# EAGLE design pCloud_ESP9266 (EAGLE 9.6.2)
COMPANY: Prime Batteries; DRAWN: Dumitrescu Adrian; REV: B

## Sheet 1 of 3: CAN 1
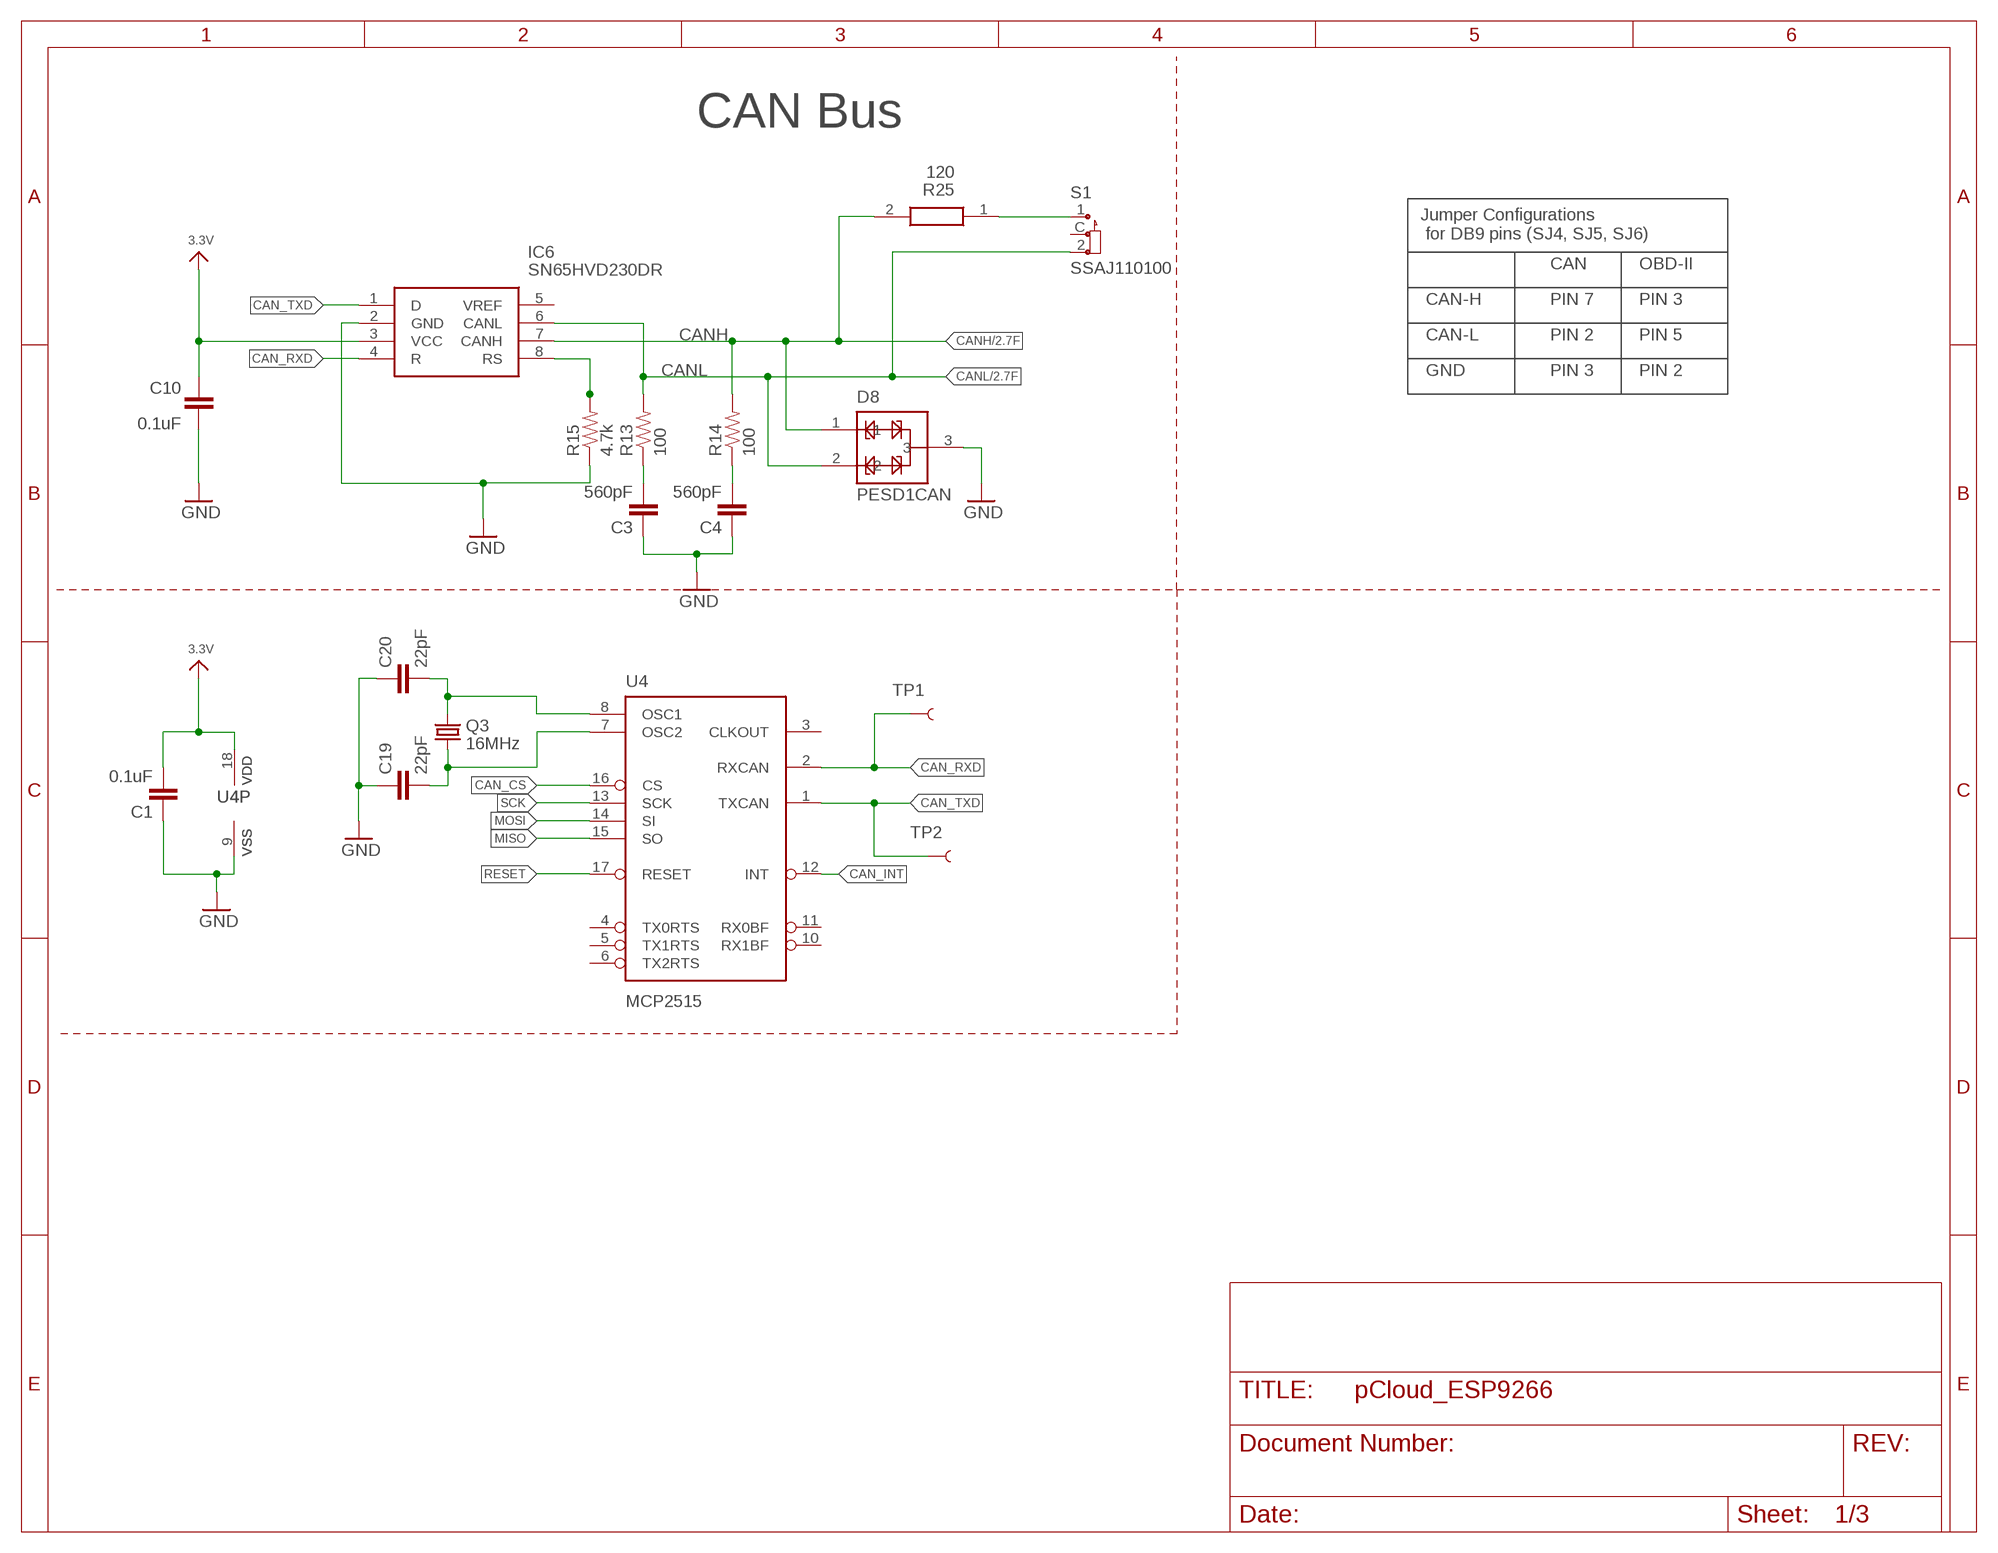
[diagram p0: schematic, sheet 1]

### Parts
C1  0.1uF  0.1UF-0603-25V-(+80/-20%)  [0603]
C3  560pF  560PF-0603-50V-5%  [0603]
C4  560pF  560PF-0603-50V-5%  [0603]
C10  0.1uF  0.1UF-0603-25V-(+80/-20%)  [0603]
C19  22pF  22PF-0603-50V-5%  [0603]
C20  22pF  22PF-0603-50V-5%  [0603]
D8  PESD1CAN  [SOT23-3]
IC6  SN65HVD230DR  [SOT127P600X175-8N]
Q3  16MHz  CRYSTAL5X3  [CRYSTAL-SMD-5X3]
R13  100  100OHM-0603-1/10W-1%  [0603]
R14  100  100OHM-0603-1/10W-1%  [0603]
R15  4.7k  4.7KOHM-0603-1/10W-1%  [0603]
R25  120  RC0603JR-7W120RL  [RESC1608X55N]
S1  SSAJ110100  [SW_SSAJ110100]
TP1  TEST-POINT3X5  [PAD.03X.05]
TP2  TEST-POINT3X5  [PAD.03X.05]
U4  MCP2515  MCP2510SO  [SO-18W]

### Nets
3.3V: C1.2 C10.2 IC6.3(VCC) U4.18(VDD) ; also sheet 2,3
CAN_CS: U4.16(CS) ; also sheet 2
CAN_INT: U4.12(INT) ; also sheet 2
CAN_RXD: IC6.4(R) TP1.P$1 U4.2(RXCAN)
CAN_TXD: IC6.1(D) TP2.P$1 U4.1(TXCAN)
CANH: D8.1 IC6.7(CANH) R14.2 R25.2 ; also sheet 2
CANL: D8.2 IC6.6(CANL) R13.2 S1.2 ; also sheet 2
GND: C1.1 C3.1 C4.1 C10.1 C19.1 C20.1 D8.3 IC6.2(GND) R15.1 U4.9(VSS) ; also sheet 2,3
MISO: U4.15(SO) ; also sheet 2
MOSI: U4.14(SI) ; also sheet 2,3
N$1: C3.2 R13.1
N$3: C4.2 R14.1
N$17: R25.1 S1.1
N$19: IC6.8(RS) R15.2
N$22: C20.2 Q3.3 U4.8(OSC1)
N$23: C19.2 Q3.1 U4.7(OSC2)
RESET: U4.17(RESET) ; also sheet 2,3
SCK: U4.13(SCK) ; also sheet 2,3
Unconnected: IC6.5(VREF) S1.C U4.3(CLKOUT) U4.4(TX0RTS) U4.5(TX1RTS) U4.6(TX2RTS) U4.10(RX1BF) U4.11(RX0BF)

### Notes on the sheet
- CAN Bus
- Jumper Configurations
   for DB9 pins (SJ4, SJ5, SJ6)
- CAN | OBD-II
- CAN-H | PIN 7 | PIN 3
- CAN-L | PIN 2 | PIN 5
- GND | PIN 3 | PIN 2

## Sheet 2 of 3: ESP8266
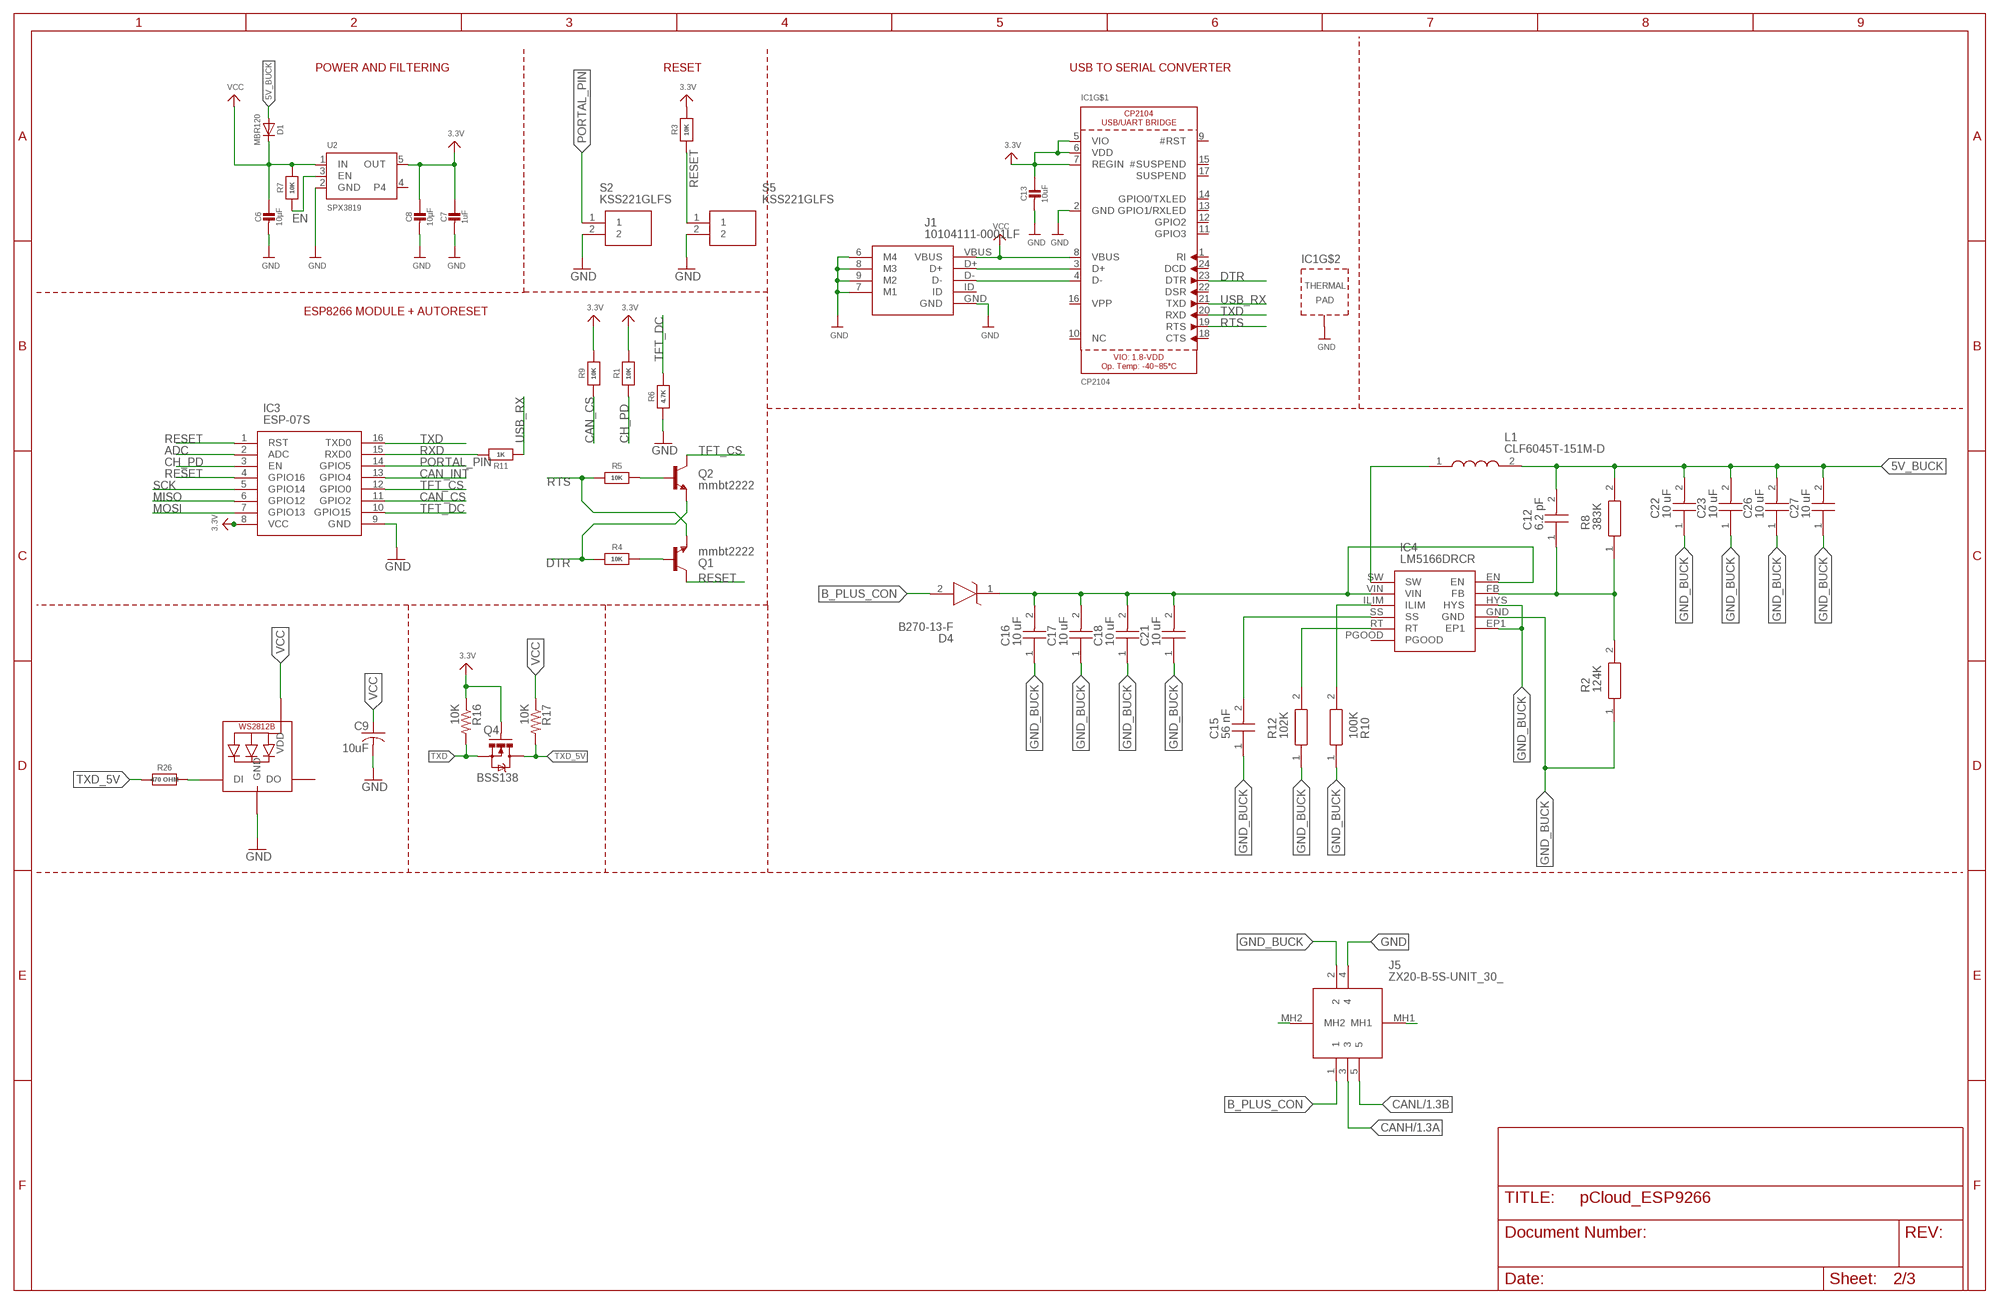
[diagram p1: schematic, sheet 2]

### Parts
C6  10µF  CAP_CERAMIC0805  [0805]
C7  1uF  CAP_CERAMIC0603  [0603]
C8  10µF  CAP_CERAMIC0805  [0805]
C9  10uF  C-USC0805K  [C0805K]
C12  6.2 pF  GCM155R71C473KA37J  [CAPC1005X55N]
C13  10uF  CAP_CERAMIC0805  [0805]
C15  56 nF  GCM155R71C473KA37J  [CAPC1005X55N]
C16  10 uF  GRM32ER72A225KA35L  [CAPC3225X270N]
C17  10 uF  GRM32ER72A225KA35L  [CAPC3225X270N]
C18  10 uF  GRM32ER72A225KA35L  [CAPC3225X270N]
C21  10 uF  GRM32ER72A225KA35L  [CAPC3225X270N]
C22  10 uF  GRM32ER72A225KA35L  [CAPC3225X270N]
C23  10 uF  GRM32ER72A225KA35L  [CAPC3225X270N]
C26  10 uF  GRM32ER72A225KA35L  [CAPC3225X270N]
C27  10 uF  GRM32ER72A225KA35L  [CAPC3225X270N]
D1  MBR120  DIODESOD-123  [SOD-123]
D4  B270-13-F  B270B-13-F  [DIOM5336X250N]
IC1  CP2104  [QFN24_4MM_SMSC]
IC3  ESP-07S  [ESP07S]
IC4  LM5166DRCR  [TPS74901DRCR]
J1  10104111-0001LF  [101041110001LF]
J5  ZX20-B-5S-UNIT_30_  [ZX20B5SUNIT30]
L1  CLF6045T-151M-D  [CLF6045T151MD]
LED4  WS2812B5050  [WS2812B]
Q1  mmbt2222  TRANSISTOR_NPNSOT23-3  [SOT23-3]
Q2  mmbt2222  TRANSISTOR_NPNSOT23-3  [SOT23-3]
Q4  BSS138  MOSFET-NCHANNELSMD  [SOT23-3]
R1  10K  RESISTOR0603  [0603]
R2  124K  RC0402FR-07100KP  [RESC1005X40N]
R3  10K  RESISTOR0603  [0603]
R4  10K  RESISTOR0603  [0603]
R5  10K  RESISTOR_0603MP  [0603]
R6  4.7K  RESISTOR0603  [0603]
R7  10K  RESISTOR0603  [0603]
R8  383K  RC0402FR-07100KP  [RESC1005X40N]
R9  10K  RESISTOR0603  [0603]
R10  100K  RC0402FR-07100KP  [RESC1005X40N]
R11  1K  RESISTOR_0603MP  [0603]
R12  102K  RC0402FR-07100KP  [RESC1005X40N]
R16  10K  RESISTOR0603-RES  [0603]
R17  10K  RESISTOR0603-RES  [0603]
R26  470 OHM  RESISTOR_0805MP  [_0805MP]
S2  KSS221GLFS  [KSS]
S5  KSS221GLFS  [KSS]
U2  SPX3819  VREG_SOT23-5  [SOT23-5]

### Nets
3.3V: C7.1 C8.1 C13.1 IC1.5(VIO) IC1.6(VDD) IC1.7(REGIN) IC3.8(VCC) Q4.1(G) R1.2 R3.2 R9.2 R16.1 U2.5(OUT) ; also sheet 1,3
5V_BUCK: C12.2 C22.2(C2) C23.2(C2) C26.2(C2) C27.2(C2) D1.A L1.2 R8.2
ADC: IC3.2(ADC)
B_PLUS: C16.2(C2) C17.2(C2) C18.2(C2) C21.2(C2) D4.1(K) IC4.EN IC4.VIN
B_PLUS_CON: D4.2(A) J5.1
CAN_CS: IC3.11(GPIO2) R9.1 ; also sheet 1
CAN_INT: IC3.13(GPIO4) ; also sheet 1
CANH: J5.3 ; also sheet 1
CANL: J5.5 ; also sheet 1
CH_PD: IC3.3(EN) R1.1
DTR: IC1.23(DTR) Q2.2(E) R4.1
EN: R7.1 U2.3(EN)
GND: C6.2 C7.2 C8.2 C9.2 C13.2 IC1.2(GND) IC1.THERM(TP) IC3.9(GND) J1.6(M4) J1.7(M1) J1.8(M3) J1.9(M2) J1.GND J5.4 LED4.3-GND(GND) R6.1 S2.2 S5.2 U2.2(GND) ; also sheet 1,3
GND_BUCK: C15.1 C16.1(C1) C17.1(C1) C18.1(C1) C21.1(C1) C22.1(C1) C23.1(C1) C26.1(C1) C27.1(C1) IC4.EP1 IC4.GND IC4.HYS J5.2 R2.1 R10.1 R12.1
MISO: IC3.6(GPIO12) ; also sheet 1
MOSI: IC3.7(GPIO13) ; also sheet 1,3
N$2: IC4.SW L1.1
N$4: IC4.ILIM R10.2
N$6: C12.1 IC4.FB R2.2 R8.1
N$9: IC1.3(D+) J1.D+
N$10: IC1.4(D-) J1.D-
N$12: Q1.1(B) R4.2
N$13: Q2.1(B) R5.2
N$14: C15.2 IC4.SS
N$15: IC4.RT R12.2
N$16: J5.MH2
N$18: J5.MH1
N$26: LED4.4-DIN(DI) R26.2
PORTAL_PIN: IC3.14(GPIO5) S2.1
RESET: IC3.1(RST) IC3.4(GPIO16) Q1.3(C) R3.1 S5.1 ; also sheet 1,3
RTS: IC1.19(RTS) Q1.2(E) R5.1
RXD: IC3.15(RXD0) R11.2
SCK: IC3.5(GPIO14) ; also sheet 1,3
TFT_CS: IC3.12(GPIO0) Q2.3(C) ; also sheet 3
TFT_DC: IC3.10(GPIO15) R6.2 ; also sheet 3
TXD: IC1.20(RXD) IC3.16(TXD0) Q4.2(S) R16.2
TXD_5V: Q4.3(D) R17.2 R26.1
USB_RX: IC1.21(TXD) R11.1
VCC: C6.1 C9.1 D1.C IC1.8(VBUS) J1.VBUS LED4.1-VDD(VDD) R7.2 R17.1 U2.1(IN)
Unconnected: IC1.1(RI) IC1.9(#RST) IC1.10(NC) IC1.11(GPIO3) IC1.12(GPIO2) IC1.13(GPIO1/RXLED) IC1.14(GPIO0/TXLED) IC1.15(#SUSPEND) IC1.16(VPP) IC1.17(SUSPEND) IC1.18(CTS) IC1.22(DSR) IC1.24(DCD) IC4.PGOOD J1.ID LED4.2-DOUT(DO) U2.4

### Notes on the sheet
- POWER AND FILTERING | RESET | USB TO SERIAL CONVERTER
- ESP8266 MODULE + AUTORESET

## Sheet 3 of 3: TFT Display 240x135 ST7789
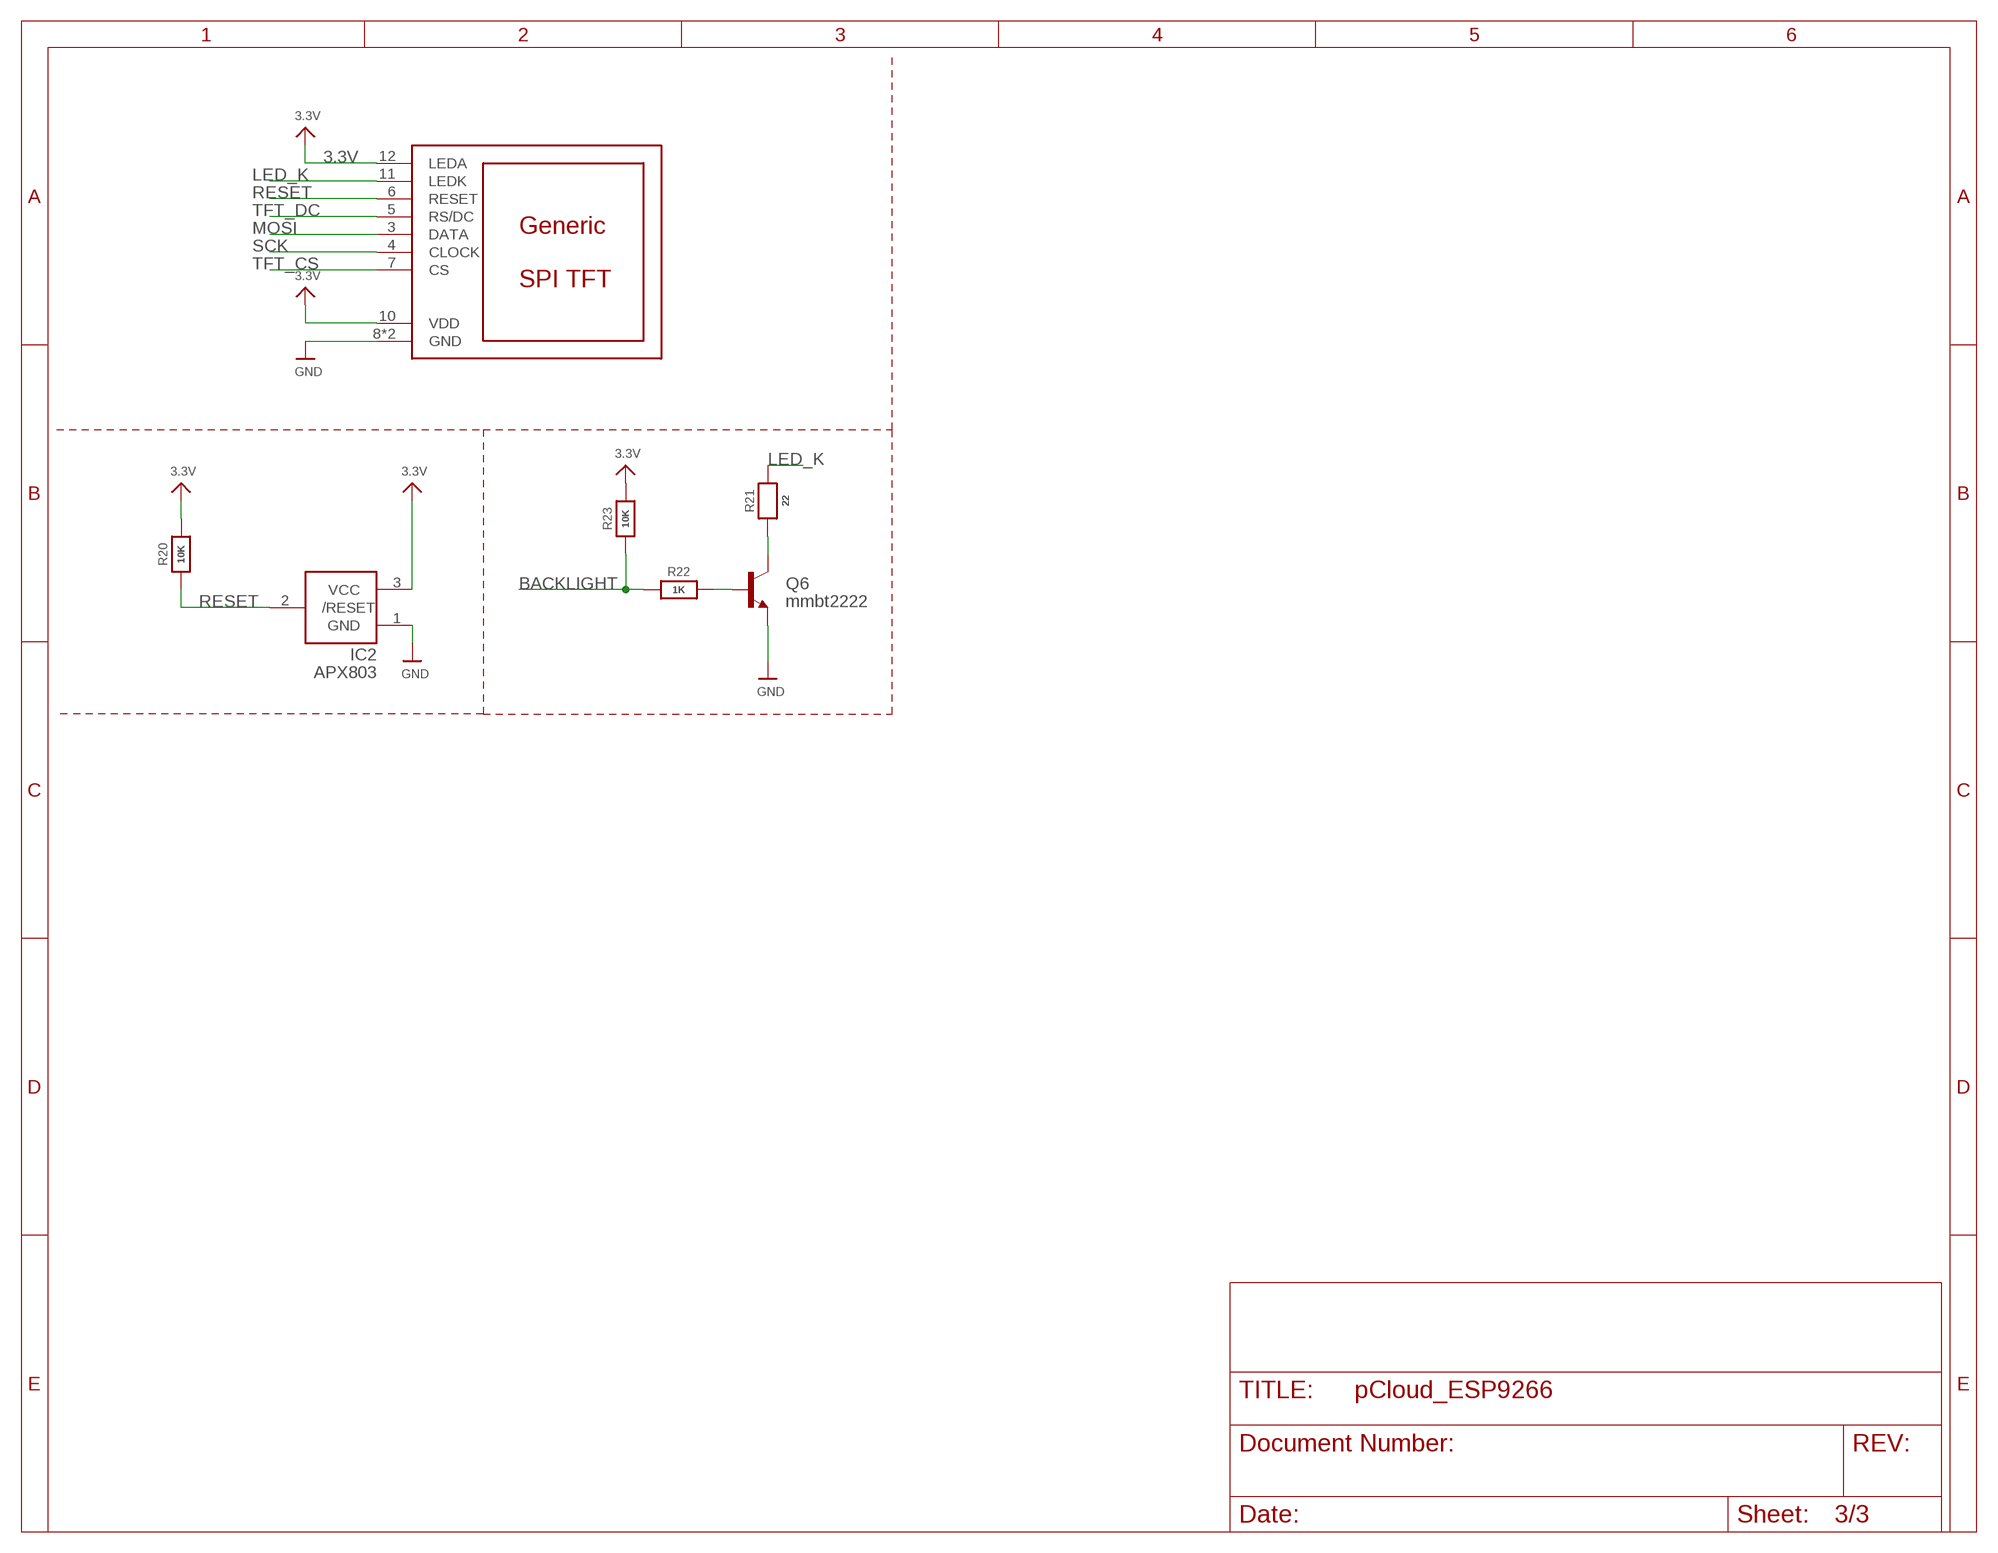
[diagram p2: schematic, sheet 3]

### Parts
DISP1  DISP_LCD_GENERIC_SPI_1.14IN_240X135_WRAPUNDER  [TFT_1.14IN_240X135_WRAPUNDER]
IC2  APX803  AXP083-SAG  [SOT23]
Q6  mmbt2222  TRANSISTOR_NPNSOT23-3  [SOT23-3]
R20  10K  RESISTOR0603  [0603]
R21  22  RESISTOR0603  [0603]
R22  1K  RESISTOR0603  [0603]
R23  10K  RESISTOR0603  [0603]

### Nets
3.3V: DISP1.10(VDD) DISP1.12(LEDA) IC2.3(VCC) R20.2 R23.2 ; also sheet 1,2
BACKLIGHT: R22.1 R23.1
GND: DISP1.8(GND) DISP1.13(GND) IC2.1(GND) Q6.2(E) ; also sheet 1,2
LED_K: DISP1.11(LEDK) R21.2
MOSI: DISP1.3(DATA) ; also sheet 1,2
N$7: Q6.1(B) R22.2
N$11: Q6.3(C) R21.1
RESET: DISP1.6(RESET) IC2.2(/RESET) R20.1 ; also sheet 1,2
SCK: DISP1.4(CLOCK) ; also sheet 1,2
TFT_CS: DISP1.7(CS) ; also sheet 2
TFT_DC: DISP1.5(RS/DC) ; also sheet 2

## Library data of the parts
C1 C10 = SparkFun-Capacitors:0.1UF: 0.1µF ceramic capacitors A capacitor is a passive two-terminal electrical component used to store electrical energy temporarily in an electric field.; PROD_ID: CAP-00810
C3 C4 = SparkFun-Capacitors:560PF: 0.56nF/560pF ceramic capacitors A capacitor is a passive two-terminal electrical component used to store electrical energy temporarily in an electric field.; PROD_ID: CAP-08749
C6-C8 C13 = microbuilder:CAP_CERAMIC: Ceramic Capacitors 0402 - 0402 Surface Mount Capacitors 16pF 50V 5% [Digikey: 445-4899-2-ND] 18pF 50V 5% [Digikey: 490-1281-2-ND] 22pF 50V 5% [Digikey: 490-1283-2-ND] 68pF 50V 5% [Digikey: 490-1289-2-ND] 0.1uF 10V 10% [Digikey: 490-1318-2-ND] 1.0uF 6.3V 10% [Digikey: 490-1320-2-ND] 0603 - 0603 Surface Mount Capacitors 16 pF 50V 5% [Digikey: 445-5051-2-ND] 22 pF 50V [Digikey: PCC220ACVTR-ND] 33 pF 50V 5% [Digikey: 490-1415-1-ND] 56pF 50V 5% [Digikey: 490-1421-1-ND] 220pF 50V 5% [Digikey: 445-1285-1-ND] 680 pF 50V 2200 pF 50V 5% C0G [Digikey: 445-1297-1-ND] 5600 pF 100V 5% X7R [Digikey: 478-3711-1-ND] 0.1 µF 25V 10% [Digikey: PCC2277TR-ND] 0.22 µF 16V 10% X7R [Digikey: 445-1318-1-ND] 1.0 µF 25V 10% [Digikey: 445-5146-2-ND] 0603 - RF Specific 3pF 250V +/-0.1pF RF [Digikey: 712-1347-1-ND] 18 pF 250V 5% [Digikey: 478-3505-1-ND or 712-1322-1-ND] 56 pF 250V 5% C0G RF [Digikey: 490-4867-1-ND] 68 pF 250V RF [Digikey: 490-4868-1-ND] 0805 - 0805 Surface Mount Capacitors 220 pF 250V 2% RF Ceramic Capacitor [Digikey: 712-1398-1-ND] 1000 pF 50V 2% NP0 Ceramic Capacitor [Digikey: 478-3760-1-ND] 0.1 µF 25V 10% Ceramic Capacitor [Digikey: PCC1828TR-ND] 1.0 µF 16V 10% Ceramic Capacitor[Digikey: 490-1691-2-ND] 10.0 µF 10V 10% Ceramic Capacitor[Digikey: 709-1228-1-ND] 10.0 uF 16V 10% Ceramic Capacitor [Digikey: 478-5165-2-ND] 47 uF 6.3V 20% Ceramic Capacitor [Digikey: 587-1779-1-ND or 399-5506-1-ND] 1206 - 1206 Surface Mount Capacitors 47uF 10V 20% Ceramic Capacitor [Digikey: 490-5528-1-ND or 399-5508-1-ND or 445-6010-1-ND] 100uF 6.3V -20%, +80% Y5V Ceramic Capacitor (Digikey: 490-4512-1-ND, Mouser: 81-GRM31CF50J107ZE1L)
C9 = rcl:C-US: CAPACITOR, American symbol; SPICEPREFIX: C
C12 C15 = GCM155R71C473KA37J:GCM155R71C473KA37J: Capacitor GCM15 L=1.0mm W=0.5mm T=0.5mm Source: Datasheet <https://psearch.en.murata.com/capacitor/product/GCM155R71C473KA37#.html>; ARROW_PART_NUMBER: GCM155R71C473KA37J; DESCRIPTION: Capacitor GCM15 L=1.0mm W=0.5mm T=0.5mm; HEIGHT: 0.55mm; MANUFACTURER_NAME: Murata Electronics; MANUFACTURER_PART_NUMBER: GCM155R71C473KA37J; MOUSER_PART_NUMBER: 81-GCM155R71C473KA7J; MOUSER_PRICE-STOCK: https://www.mouser.co.uk/ProductDetail/Murata-Electronics/GCM155R71C473KA37J?qs=N3Kl9KD794QyuG7xlAebbw%3D%3D
C16-C18 C21-C23 C26 C27 = GRM32ER72A225KA35L:GRM32ER72A225KA35L: CAPACITOR, 1210 2.2uF +/-10% 100V Source: Datasheet; ARROW_PART_NUMBER: GRM32ER72A225KA35L; ARROW_PRICE-STOCK: https://www.arrow.com/en/products/grm32er72a225ka35l/murata-manufacturing; DESCRIPTION: CAPACITOR, 1210 2.2uF +/-10% 100V; HEIGHT: mm; MANUFACTURER_NAME: Murata Electronics; MANUFACTURER_PART_NUMBER: GRM32ER72A225KA35L; MOUSER_PART_NUMBER: 81-GRM32ER72A225KA35; MOUSER_PRICE-STOCK: https://www.mouser.co.uk/ProductDetail/Murata-Electronics/GRM32ER72A225KA35L?qs=CHiu0TXTCq%252BaecLZfNuvaA%3D%3D
C19 C20 = SparkFun-Capacitors:22PF: 22pF ceramic capacitors A capacitor is a passive two-terminal electrical component used to store electrical energy temporarily in an electric field.; PROD_ID: CAP-07876
D1 = microbuilder:DIODE: Diode SMA Model Volts Amps Type Vf Vr Digikey # Notes SSA34-E3 40V 3A Schottky 480mV @ 3A 200uA @ 40V SSA34-E3/61TGITR-ND CDBA120-G 20V 1A Schottky 500mV @ 1A 500uA @ 20V 641-1014-6-ND REEL MBRA210 10V 2A Schottky 350mV @ 2A 700uA @ 10V MBRA210LT3 SOD-123 Model Volts Amps Type Vf Vr Order # Notes BAT54T1G 30V 200mA Schottky 800mV @ 200mA 2uA @ 25V BAT54T1GOSTR-ND B0530W 30V 500mA Schottky 430mV @ 500mA 130uA @ 30V B0530W-FDICT-ND REEL MBR120 1A 20V Schottky 340mV @ 1A MBR120VLSFT1GOSCT-ND SOD-323 Model Volts Amps Type Vf Vr Order # Notes PMEG2005EJ 20V 500mA Schottky 355mV @ 500mA 568-4110-1-ND ZLLS410 10V 570mA Schottky 380mV @ 570mA ZLLS410CT-ND 1N4148WS 75V 150mA Silicon/Simple 1V 1N4148WSFSCT-ND REEL SOD-523 Model Volts Amps Type Vf Vr Order # Notes BAT54XV2 30V 200mA Schottky 0.8V @ 100mA BAT54XV2CT-ND TB751S 30V 30mA Schottky RB751S-40TE61CT-ND SOT23-R/W (R = Solder Paste/Reflow Ovens, W = Hand-Soldering) Model Volts Amps Type Vf Vr Order # Notes BAT54FILM 40V 300mA Schottky 497-7162-1-ND
D4 = B270B-13-F:B270B-13-F: Diodes Inc B170B-13-F, SMT Schottky Diode, 70V 1A, 2-Pin DO-214AA Source: Datasheet <http://uk.rs-online.com/web/p/products/7513219>; ARROW_PART_NUMBER: B170B-13-F; ARROW_PRICE-STOCK: https://www.arrow.com/en/products/b170b-13-f/diodes-incorporated; DESCRIPTION: Diodes Inc B170B-13-F, SMT Schottky Diode, 70V 1A, 2-Pin DO-214AA; HEIGHT: 2.5mm; MANUFACTURER_NAME: Diodes Inc.; MANUFACTURER_PART_NUMBER: B170B-13-F
D8 = SparkFun-DiscreteSemi:PESD1CAN: PESD1CAN is used to protect two automotive CAN bus lines from ESD.; PROD_ID: DIO-12501
DISP1 = microbuilder:DISP_LCD_GENERIC_SPI
IC1 = microbuilder:CP2104: CP2104 - USB to UART Bridge VDD Output: 3.45V
IC2 = adafruit:AXP083
IC3 = ESP-07S:ESP-07S: RF Solutions ESP-07S 3 3.6V WiFi Module, FTP, HTTP, IPv4, TCP/IP GPIO, HSPI, I2C, I2S, IR, PWM, UART Source: Datasheet <https://www.rfsolutions.co.uk/downloads/1494602250ESP-07S_Datasheet.pdf>; DESCRIPTION: RF Solutions ESP-07S 3 3.6V WiFi Module, FTP, HTTP, IPv4, TCP/IP GPIO, HSPI, I2C, I2S, IR, PWM, UART; HEIGHT: 3mm; MANUFACTURER_NAME: RF SOLUTIONS; MANUFACTURER_PART_NUMBER: ESP-07S; MOUSER_PART_NUMBER: 223-ESP-07S; MOUSER_PRICE-STOCK: https://www.mouser.com/Search/Refine.aspx?Keyword=223-ESP-07S; RS_PART_NUMBER: 1372785; RS_PRICE-STOCK: http://uk.rs-online.com/web/p/products/1372785
IC4 = LM5166DRCR:LM5166DRCR: 3V-65V Input, 500mA Synchronous Buck Converter With Ultra-Low Iq Source: Datasheet <http://www.ti.com/lit/gpn/LM5166>; ARROW_PART_NUMBER: LM5166DRCR; ARROW_PRICE-STOCK: https://www.arrow.com/en/products/lm5166drcr/texas-instruments; DESCRIPTION: 3V-65V Input, 500mA Synchronous Buck Converter With Ultra-Low Iq; HEIGHT: mm; MANUFACTURER_NAME: Texas Instruments; MANUFACTURER_PART_NUMBER: LM5166DRCR; MOUSER_PART_NUMBER: 595-LM5166DRCR; MOUSER_PRICE-STOCK: https://www.mouser.co.uk/ProductDetail/Texas-Instruments/LM5166DRCR?qs=34RfhUjJmKfBnYp2E2XqEQ%3D%3D
IC6 = SN65HVD230DR:SN65HVD230DR: 3.3 V CAN Transceiver with Standby Mode Source: Datasheet <http://www.ti.com/lit/gpn/sn65hvd230>; ARROW_PART_NUMBER: SN65HVD230DR; ARROW_PRICE-STOCK: https://www.arrow.com/en/products/sn65hvd230dr/texas-instruments; DESCRIPTION: 3.3 V CAN Transceiver with Standby Mode; HEIGHT: 1.75mm; MANUFACTURER_NAME: Texas Instruments; MANUFACTURER_PART_NUMBER: SN65HVD230DR; MOUSER_PART_NUMBER: 595-SN65HVD230DR; MOUSER_PRICE-STOCK: https://www.mouser.co.uk/ProductDetail/Texas-Instruments/SN65HVD230DR?qs=QViXGNcIEAtifeQR3pYVUQ%3D%3D
J1 = 10104111-0001LF:10104111-0001LF: USB Connectors 5P Quick Connect MicroUSB TypeAB Rcpt Source: Datasheet <https://cdn.amphenol-icc.com/media/wysiwyg/files/drawing/10104111.pdf>; ARROW_PART_NUMBER: 10104111-0001LF; ARROW_PRICE-STOCK: https://www.arrow.com/en/products/10104111-0001lf/amphenol-fci; DESCRIPTION: USB Connectors 5P Quick Connect MicroUSB TypeAB Rcpt; HEIGHT: 3.07mm; MANUFACTURER_NAME: Amphenol; MANUFACTURER_PART_NUMBER: 10104111-0001LF; MOUSER_PART_NUMBER: 649-10104111-0001LF; MOUSER_PRICE-STOCK: https://www.mouser.co.uk/ProductDetail/Amphenol-FCI/10104111-0001LF?qs=3wMSRtz0%252BRo6OB1MLyfdZQ%3D%3D
J5 = ZX20-B-5S-UNIT_30_:ZX20-B-5S-UNIT_30_: ZX series micro B USB PCB plug, 5P Source: Datasheet <https://www.hirose.com/product/en/download_file/key_name/ZX20-B-5S-UNIT(30)/category/Drawing (2D)/doc_file_id/55228/?file_category_id=6&item_id=02420012830&is_series=>; ARROW_PART_NUMBER: ZX20-B-5S-UNIT(30); ARROW_PRICE-STOCK: https://www.arrow.com/en/products/zx20-b-5s-unit-30/hirose-electric; DESCRIPTION: ZX series micro B USB PCB plug, 5P; HEIGHT: 12mm; MANUFACTURER_NAME: Hirose; MANUFACTURER_PART_NUMBER: ZX20-B-5S-UNIT(30); MOUSER_PART_NUMBER: 798-ZX20-B-5S-UNIT30; MOUSER_PRICE-STOCK: https://www.mouser.co.uk/ProductDetail/Hirose-Connector/ZX20-B-5S-UNIT30?qs=4J5DPWWS9EDebfocK0CE4A%3D%3D
L1 = CLF6045T-151M-D:CLF6045T-151M-D: TDK CLF6045-D Series Shielded Wire-wound SMD Inductor with a Ferrite Core, 150 uH +/-20% 0.6A Idc Source: Datasheet <https://product.tdk.com/en/search/inductor/inductor/smd/info?part_no=CLF6045T-151M-D>; ARROW_PART_NUMBER: CLF6045T-151M-D; ARROW_PRICE-STOCK: https://www.arrow.com/en/products/clf6045t-151m-d/tdk; DESCRIPTION: TDK CLF6045-D Series Shielded Wire-wound SMD Inductor with a Ferrite Core, 150 uH +/-20% 0.6A Idc; HEIGHT: 4.8mm; MANUFACTURER_NAME: TDK; MANUFACTURER_PART_NUMBER: CLF6045T-151M-D; MOUSER_PART_NUMBER: 810-CLF6045T-151M-D; MOUSER_PRICE-STOCK: https://www.mouser.co.uk/ProductDetail/TDK/CLF6045T-151M-D?qs=ilIqL0%2F%2FoDUAXj%252B6amo8qA%3D%3D
LED4 = adafruit:WS2812B
Q1 Q2 Q6 = SparkFun:TRANSISTOR_NPN: Transistor NPN BJT configuration in SOT23 package. MMBT2222 is the common NPN we use. Double check BCE configuration again layout.
Q3 = SparkFun-FreqCtrl:CRYSTAL: Various standard crystals. Proven footprints.; PROD_ID: XTAL-08218
Q4 = SparkFun:MOSFET-NCHANNEL
R1 R3-R7 R9 R11 R20-R23 R26 = microbuilder:RESISTOR: Resistors 0402 - 0402 Surface Mount Package 22 Ohm 1% 1/16W [Digikey: 311-22.0LRTR-ND] 33 Ohm 5% 1/16W 1.0K 5% 1/16W 1.5K 5% 1/16W 2.0K 1% 1/16W 10.0K 1% 1/16W [Digikey: 311-10.0KLRTR-ND] 10.0K 5% 1/16W [Digikey: RMCF0402JT10K0TR-ND] 12.1K 1% 1/16W [Digikey: 311-22.0LRTR-ND] 100.0K 5% 1/16W 0603 - 0603 Surface Mount Package 0 Ohm 1/10 Watt 1% Resistor 15 Ohm 1/10 Watt 1% Resistor 33 Ohm 1/10 Watt 1% Resistor 49.9 Ohm 1/10 Watt 1% Resistor 100 Ohm 1/10 Watt 1% Resistor 150 Ohm 1/10 Watt 1% Resistor 240 Ohm 1/10 Watt 1% Resistor 390 Ohm 1/10 Watt 1% Resistor 560 Ohm 1/10 Watt 1% Resistor 680 Ohm 1/10 Watt 1% Resistor 750 Ohm 1/10 Watt 1% Resistor 1.0K Ohm 1/10 Watt 1% Resistor 1.5K Ohm 1/10 Watt 1% Resistor 2.0K Ohm 1/10 Watt 1% Resistor 2.2K Ohm 1/10 Watt 1% Resistor 3.3K Ohm 1/10 Watt 1% Resistor 4.7K Ohm 1/10 Watt 1% Resistor 10.0K Ohm 1/10 Watt 1% Resistor 12.0K Ohm 1/10 Watt 1% Resistor 12.1K Ohm 1/10 Watt 1% Resistor 20.0K Ohm 1/10 Watt 1% Resistor 33.0K Ohm 1/10 Watt 1% Resistor 100.0K Ohm 1/10 Watt 1% Resistor 0805 - 0805 Surface Mount Package 0 Ohm 1/8 Watt 1% Resistor 33 Ohm 1/8 Watt 1% Resistor 100 Ohm 1/8 Watt 1% Resistor 150 Ohm 1/8 Watt 1% Resistor 200 Ohm 1/8 Watt 1% Resistor 240 Ohm 1/8 Watt 1% Resistor 330 Ohm 1/8 Watt 1% Resistor 390 Ohm 1/8 Watt 1% Resistor 470 Ohm 1/8 Watt 1% Resistor 1.0K Ohm 1/8 Watt 1% Resistor 1.5K Ohm 1/8 Watt 1% Resistor 2.0K Ohm 1/8 Watt 1% Resistor 4.7K Ohm 1/8 Watt 1% Resistor 5.1K Ohm 1/8 Watt 1% Resistor 5.6K Ohm 1/8 Watt 1% Resistor 10.0K Ohm 1/8 Watt 1% Resistor 22.0K Ohm 1/8 Watt 1% Resistor 33.0K Ohm 1/8 Watt 1% Resistor 100K Ohm 1/8 Watt 1% Resistor 1206 - 1206 Surface Mount Package 2012 - 2010 Surface Mount Package 0.11 Ohm 1/2 Watt 1% Resistor - Digikey: RHM.11UCT-ND
R2 R8 R10 R12 = RC0402FR-07100KP:RC0402FR-07100KP: Res Thick Film 0402 100K Ohm 1% 0.063W(1/16W) +/-150ppm/C Epoxy Pad SMD T/R Source: Datasheet <https://www.arrow.com/en/products/rc0402fr-07100kp/yageo>; ARROW_PART_NUMBER: RC0402FR-07100KP; ARROW_PRICE-STOCK: https://www.arrow.com/en/products/rc0402fr-07100kp/yageo; DESCRIPTION: Res Thick Film 0402 100K Ohm 1% 0.063W(1/16W) +/-150ppm/C Epoxy Pad SMD T/R; HEIGHT: 0.4mm; MANUFACTURER_NAME: YAGEO (PHYCOMP); MANUFACTURER_PART_NUMBER: RC0402FR-07100KP; MOUSER_PART_NUMBER: 603-RC0402FR-07100KP; MOUSER_PRICE-STOCK: https://www.mouser.com/Search/Refine.aspx?Keyword=603-RC0402FR-07100KP
R13 R14 = SparkFun-Resistors:100OHM: 100Ω resistor A resistor is a passive two-terminal electrical component that implements electrical resistance as a circuit element. Resistors act to reduce current flow, and, at the same time, act to lower voltage levels within circuits. - Wikipedia; PROD_ID: RES-07863
R15 = SparkFun-Resistors:4.7KOHM: 4.7kΩ resistor A resistor is a passive two-terminal electrical component that implements electrical resistance as a circuit element. Resistors act to reduce current flow, and, at the same time, act to lower voltage levels within circuits. - Wikipedia; PROD_ID: RES-07857
R16 R17 = SparkFun:RESISTOR: Resistor Basic schematic elements and footprints for 0603, 1206, and PTH resistors.
R25 = RC0603JR-7W120RL:RC0603JR-7W120RL: Thick Film Resistors - SMD Source: Datasheet <http://www.yageo.com/documents/recent/PYu-RC0603_51_RoHS_L_v5.pdf>; ARROW_PART_NUMBER: RC0603JR-7W120RL; DESCRIPTION: Thick Film Resistors - SMD; HEIGHT: 0.55mm; MANUFACTURER_NAME: YAGEO (PHYCOMP); MANUFACTURER_PART_NUMBER: RC0603JR-7W120RL; MOUSER_PART_NUMBER: 603-RC0603JR-7W120RL; MOUSER_PRICE-STOCK: https://www.mouser.co.uk/ProductDetail/Yageo/RC0603JR-7W120RL?qs=tggtontpCXMM9bYRhksEcA%3D%3D
S1 = SSAJ110100:SSAJ110100: Slide Switch • Rating (max.): 10 mA 5 VDC • Poles: 1 • Positions: 2 • Travel : 1.4 mm • Operating direction: Horizontal Check prices <https://snapeda.com/parts/SSAJ110100/ALPS/view-part/?ref=eda>; AVAILABILITY: Warning; DESCRIPTION: Slide Switch • Rating (max.): 10 mA 5 VDC • Poles: 1 • Positions: 2 • Travel : 1.4 mm • Operating direction: Horizontal; MF: ALPS; MOUSER-PURCHASE-URL: https://snapeda.com/shop?store=Mouser&id=460564; MP: SSAJ110100; PACKAGE: None; PRICE: None
S2 S5 = KSS221GLFS:KSS221GLFS: IP40 Side Tactile Switch, SPST-NO 50 mA Source: Datasheet <http://docs-emea.rs-online.com/webdocs/129c/0900766b8129cd37.pdf>; ARROW_PART_NUMBER: KSS221GLFS; ARROW_PRICE-STOCK: https://www.arrow.com/en/products/kss221glfs/ck; DESCRIPTION: IP40 Side Tactile Switch, SPST-NO 50 mA; HEIGHT: mm; MANUFACTURER_NAME: C & K COMPONENTS; MANUFACTURER_PART_NUMBER: KSS221GLFS; MOUSER_PART_NUMBER: 611-KSS221GLFS; MOUSER_PRICE-STOCK: https://www.mouser.co.uk/ProductDetail/CK/KSS221GLFS?qs=vOd3edNlRKBuiHMPlaHoZw%3D%3D
TP1 TP2 = SparkFun-Passives:TEST-POINT: Bare copper test points for troubleshooting or ICT
U2 = microbuilder:VREG_SOT23-5: SOT23-5 Fixed Voltage Regulators To better organise some of the SOT23-5 fixed voltage regulators in this library, this new part was created. Part Current Out V Out V In V Dropout Digikey Part No. ADP121 150mA 3.3V 3.4-5.5V 0.09V @ 150mA ADP121-AUJZ33R7CT-ND ADP121 150mA 3.0V 3.1-5.5V 0.09V @ 150mA ADP121-AUJZ30R7CT-ND ADP122 300mA 3.3V 3.4-5.5V 0.085V @ 300mA ADP122AUJZ-3.3-R7CT-ND ADP1712 300mA 3.3V 3.5-5.5V 0.17V @ 300mA ADP1712AUJZ-3.3-R7TR-ND AP7311 (Low Cost) 150mA 3.3V 3.5-6V 0.15V @ 150mA AP7311-33WG-7DICT-ND LD39015M18R 150mA 1.8V 1.9V-5.5V 0.08V @ 100mA 497-6977-1-ND MCP1824T-3302E/OT 300mA 3.3V 3.5V-6V 0.2V @ 300mA MCP1824T-3302E/OTCT-ND MIC5205-2.5YM5 TR 150mA 2.5V 2.7-16V 0.165V @ 150mA 576-1257-2-ND MIC5205-3.0YM5 TR 150mA 3.0V 3.2V-16V 0.165V @ 150mA 576-1258-2-ND MIC5205-3.3YM5 TR 150mA 3.3V 3.5V-16V 0.165V @ 150mA 576-1259-2-ND TPS780330220 150mA 3.3V+2.2V 3.6-5.5V 250mV Max 296-23332-1-ND TDA3663/N1,135 100mA 3.3V 3.5-45V 0.18V @ 50mA 568-5343-1-ND
U4 = SparkFun-DigitalIC:MCP2510: CAN controller with SPI interface to any MCU. Original design by Microchip.; PROD_ID: IC-09906

## Net classes
1 vcc: width 0.254 mm

## Board
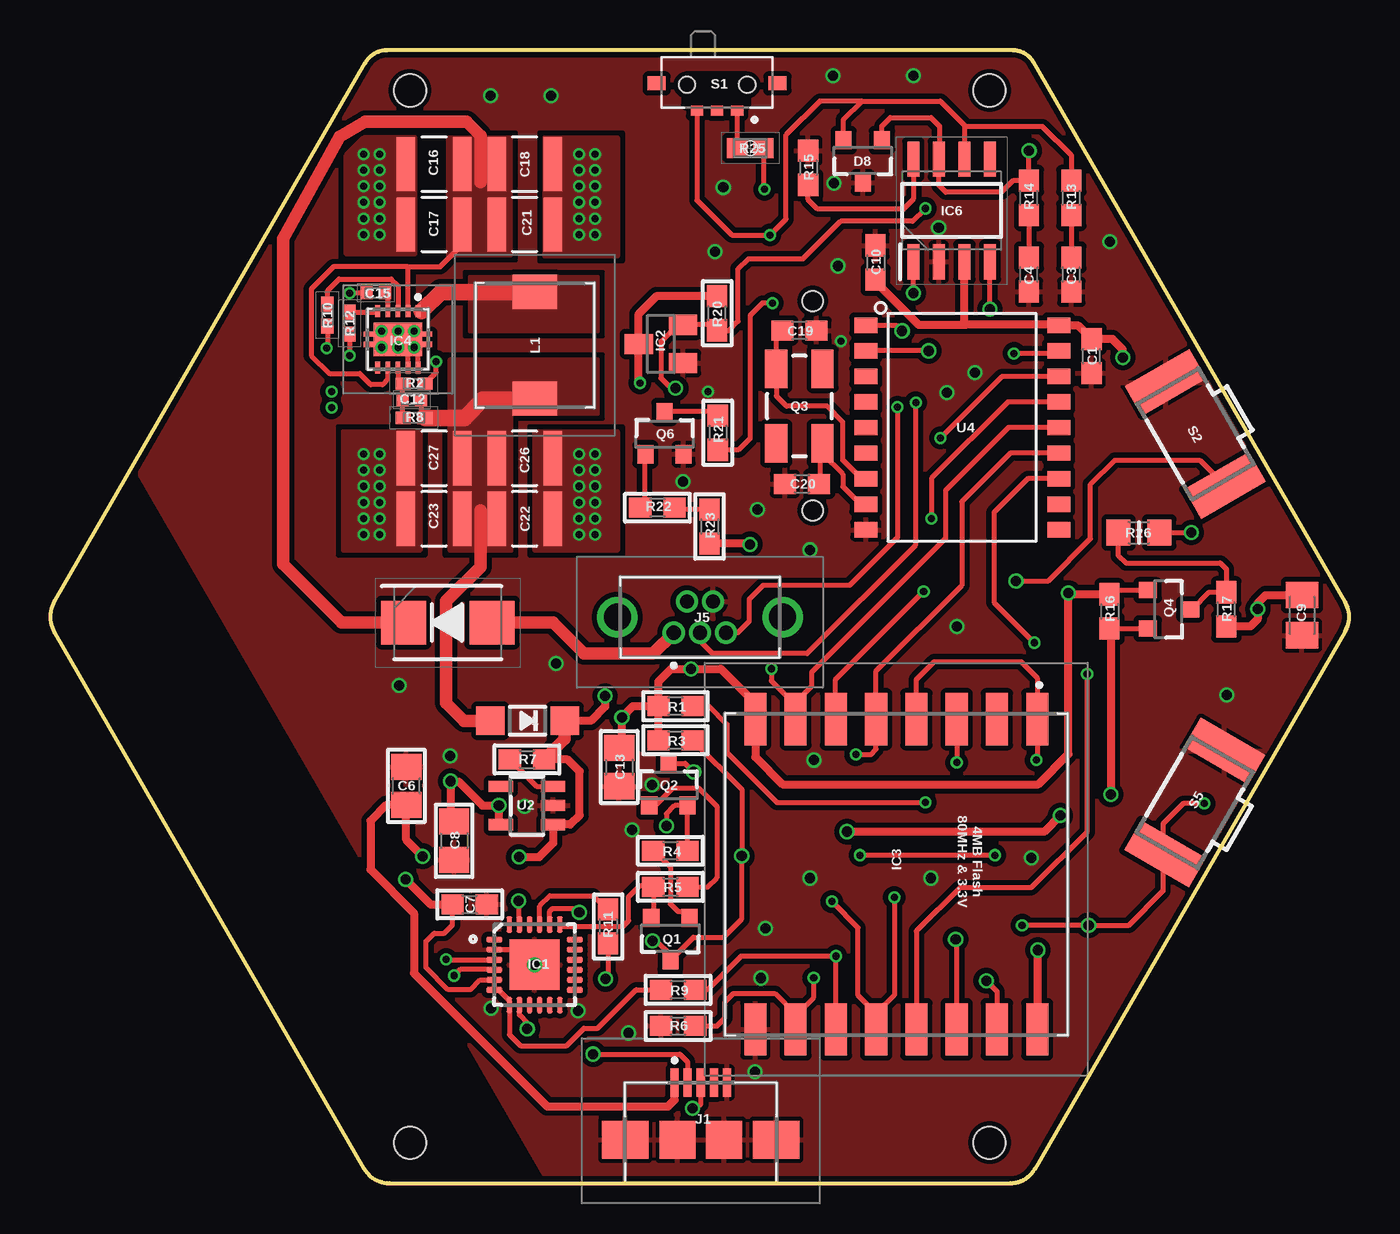
[diagram p3: board, top side]
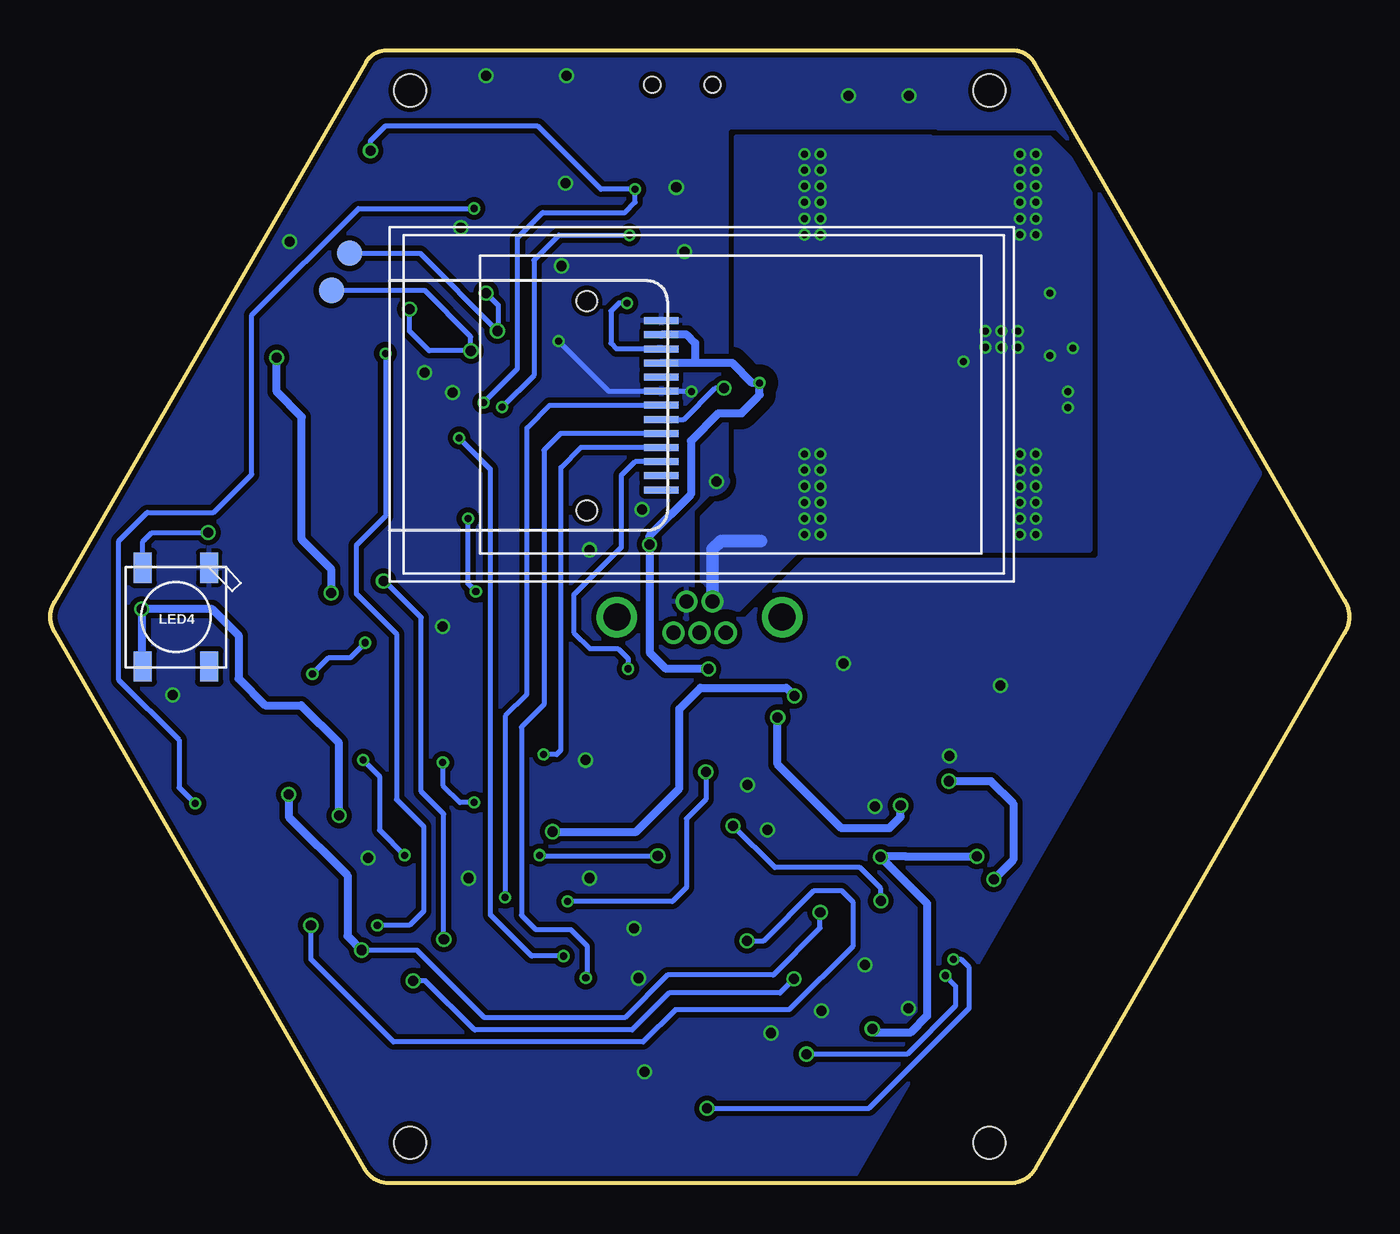
[diagram p4: board, bottom side, seen from below]

Size 64.5 x 56.26 mm. Coordinates in mm from the lower left corner, seen from the top.
Outline: 47.81,56.26 16.71,56.26 arc60 15.64,55.65 0.21,28.92 arc60 0.21,27.35 15.58,0.73 arc60 16.84,0 47.68,0 arc60 48.88,0.69 64.31,27.41 arc60 64.31,28.85 48.82,55.68 arc60 47.81,56.26
Copper layers (1*16): Top 0.018mm / dielectric 1.55mm / Bottom 0.018mm
Design rules "eC_2Layer_PClass6_BaseCopperO18_eCDefault": minimum track width 0.15mm, minimum drill 0.35mm, track to track 0.15mm, track to pad 0.15mm, pad to pad 0.15mm, via to via 0.15mm, smd to smd 0mil, copper to edge 0.25mm, drill to drill 0.35mm, minimum pad ring 0.175mm, minimum via ring 0.125mm, stop-mask expansion 0mil, vias tented up to drill 0.45mm, thermal gap 0.2mm
Holes 1.6 mm at 17.86,2.01 46.64,2.01 46.64,54.27 17.86,54.27

### Footprints (pad centres in the part's own frame; a part is rotated, then mirrored left to right if it is on the bottom)
0603 = smd 1.1 x 1: 1 -0.85,0; 2 0.85,0
0805 = smd 1.3 x 1.5: 1 -0.95,0; 2 0.95,0
C0805K = smd 1.3 x 1.6: 1 -1,0; 2 1,0
CAPC1005X55N = smd 0.6 x 0.62: 1 -0.46,0; 2 0.46,0
CAPC3225X270N = smd 0.914 x 2.692: 1 -1.397,0; 2 1.397,0
SOD-123 = smd 1.4 x 1.4: A 1.85,0; C -1.85,0
DIOM5336X250N = smd 2.25 x 2.15: 1 -2.2,0; 2 2.2,0
SOT23-3 = smd 0.8 x 0.9: 1 -0.95,-1; 2 0.95,-1; 3 0,1.1
TFT_1.14IN_240X135_WRAPUNDER = smd 0.35 x 1.7: 1 4.24,13.5; 2 3.54,13.5; 3 2.84,13.5; 4 2.14,13.5; 5 1.44,13.5; 6 0.74,13.5; 7 0.04,13.5; 8 -0.66,13.5; 9 -1.36,13.5; 10 -2.06,13.5; 11 -2.76,13.5; 12 -3.46,13.5; 13 -4.16,13.5 | hole 1: -5.14,9.8; 5.26,9.8
QFN24_4MM_SMSC = smd 0.8 x 0.28: 1 -2,1.25; 2 -2,0.75; 3 -2,0.25; 4 -2,-0.25; 5 -2,-0.75; 6 -2,-1.25; 13 2,-1.25; 14 2,-0.75; 15 2,-0.25; 16 2,0.25; 17 2,0.75; 18 2,1.25 | smd 0.28 x 0.8: 7 -1.25,-2; 8 -0.75,-2; 9 -0.25,-2; 10 0.25,-2; 11 0.75,-2; 12 1.25,-2; 19 1.25,2; 20 0.75,2; 21 0.25,2; 22 -0.25,2; 23 -0.75,2; 24 -1.25,2 | smd 2.5 x 2.5: THERM 0,0
SOT23 = smd 1 x 1.4: 1 -0.95,-1.1; 2 0.95,-1.1; 3 0,1.1
ESP07S = smd 2.6 x 1.1: 1 -6.95,7; 2 -6.95,5; 3 -6.95,3; 4 -6.95,1; 5 -6.95,-1; 6 -6.95,-3; 7 -6.95,-5; 8 -6.95,-7; 9 8.45,-7; 10 8.45,-5; 11 8.45,-3; 12 8.45,-1; 13 8.45,1; 14 8.45,3; 15 8.45,5; 16 8.45,7
TPS74901DRCR = smd 0.6 x 0.24: EN 1.4,-0.5; FB 1.4,0; GND 1.4,1; HYS 1.4,0.5; ILIM -1.4,0; PGOOD 1.4,-1; RT -1.4,-1; SS -1.4,-0.5; SW -1.4,1; VIN -1.4,0.5 | smd 1.65 x 2.4: EP1 0,0 | smd 0.25 x 0.5: EP2 -0.25,1.45; EP3 0.25,1.45; EP4 -0.25,-1.45; EP5 0.25,-1.45
SOT127P600X175-8N = smd 1.75 x 0.6: 1 -2.55,1.905; 2 -2.55,0.635; 3 -2.55,-0.635; 4 -2.55,-1.905; 5 2.55,-1.905; 6 2.55,-0.635; 7 2.55,0.635; 8 2.55,1.905
101041110001LF = smd 2.3 x 1.9: 6 -3.75,2.15; 7 3.75,2.15 | smd 1.8 x 1.9: 8 -1.15,2.15; 9 1.15,2.15 | smd 0.4 x 1.4: D+ 0,5; D- -0.65,5; GND 1.3,5; ID 0.65,5; VBUS -1.3,5
ZX20B5SUNIT30 = drill 0.7 pad 1.1: 1 -1.3,-0.775; 2 -0.65,0.775; 3 0,-0.775; 4 0.65,0.775; 5 1.3,-0.775 | drill 1.342 pad 2.012: MH1 4.1,0; MH2 -4.1,0
CLF6045T151MD = smd 1.7 x 2.2: 1 -2.65,0; 2 2.65,0
WS2812B = smd 1.5 x 0.9: 1-VDD 2.45,-1.65; 2-DOUT 2.45,1.65; 3-GND -2.45,1.65; 4-DIN -2.45,-1.65
CRYSTAL-SMD-5X3 = smd 1.9 x 1.1: 1 -1.85,-1.15; 2 1.85,-1.15; 3 1.85,1.15; 4 -1.85,1.15
RESC1005X40N = smd 0.75 x 0.6: 1 -0.55,0; 2 0.55,0
RESC1608X55N = smd 1 x 1: 1 -0.65,0; 2 0.65,0
_0805MP = smd 1.2 x 1.3: 1 -1.016,0; 2 1.016,0
SW_SSAJ110100 = smd 0.6 x 0.51: 1 -1,1.355; 2 1,1.355; C 0,1.355 | smd 0.9 x 0.7: S1 3,0; S2 -3,0 | hole 0.8: -1.5,0.075; 1.5,0.075
KSS = smd 1.7 x 3.7: 1 -2.95,0; 2 2.95,0
PAD.03X.05 = smd 1.27 x 1.27: P$1 0,0
SOT23-5 = smd 0.55 x 1.2: 1 -0.95,-1.3; 2 0,-1.3; 3 0.95,-1.3; 4 0.95,1.3; 5 -0.95,1.3
SO-18W = smd 0.762 x 1.143: 1 -5.08,-4.788; 2 -3.81,-4.788; 3 -2.54,-4.788; 4 -1.27,-4.788; 5 0,-4.788; 6 1.27,-4.788; 7 2.54,-4.788; 8 3.81,-4.788; 9 5.08,-4.788; 10 5.08,4.788; 11 3.81,4.788; 12 2.54,4.788; 13 1.27,4.788; 14 0,4.788; 15 -1.27,4.788; 16 -2.54,4.788; 17 -3.81,4.788; 18 -5.08,4.788

### Placement (x,y rotation side)
C1  51.71,41.08 90 top
C3  50.71,45.12 90 top
C4  48.6,45.12 90 top
C6  17.68,19.73 90 top
C7  20.83,13.84 0 top
C8  20.06,17.01 270 top
C9  62.16,28.21 270 top
C10  40.98,45.72 270 top
C12  17.96,38.91 0 top
C13  28.25,20.66 270 top
C15  16.16,44.21 0 top
C16  19.06,50.61 0 top
C17  19.06,47.61 0 top
C18  23.56,50.61 180 top
C19  37.2,42.35 180 top
C20  37.33,34.73 0 top
C21  23.56,47.61 180 top
C22  23.56,33 180 top
C23  19.06,33 0 top
C26  23.56,36 180 top
C27  19.06,36 0 top
D1  23.7,22.97 180 top
D4  19.74,27.84 0 top
D8  40.35,50.8 180 top
DISP1  47.66,38.68 270 bottom
IC1  24.05,10.85 0 top
IC2  30.32,41.68 90 top
IC3  42.01,16.09 270 top
IC4  17.26,41.91 270 top
IC6  44.76,48.31 90 top
J1  32.3,0 0 top
J5  32.26,28.11 0 top
L1  24.06,41.61 270 top
LED4  58.26,28.11 270 bottom
Q1  30.79,12.17 180 top
Q2  30.69,19.76 0 top
Q3  37.2,38.59 270 top
Q4  55.5,28.5 270 top
Q6  30.5,37.2 0 top
R1  31.05,23.69 180 top
R2  18.06,39.71 180 top
R3  31.05,22 180 top
R4  30.79,16.51 180 top
R5  30.79,14.71 0 top
R6  31.17,7.81 0 top
R7  23.67,21.04 0 top
R8  18.06,38.01 0 top
R9  31.17,9.61 180 top
R10  13.76,43.11 90 top
R11  27.7,12.75 270 top
R12  14.86,42.71 90 top
R13  50.71,48.93 90 top
R14  48.6,48.93 90 top
R15  37.64,50.43 270 top
R16  52.6,28.4 270 top
R17  58.4,28.5 90 top
R20  33.11,43.2 90 top
R21  33.14,37.27 270 top
R22  30.15,33.55 180 top
R23  32.73,32.61 270 top
R25  34.76,51.41 0 top
R26  54.06,32.31 0 top
S1  33.11,54.62 180 top
S2  56.86,37.21 120 top
S5  56.83,18.91 60 top
TP1  50.54,44.34 0 bottom
TP2  49.64,46.18 0 bottom
U2  23.67,18.76 90 top
U4  45.29,37.53 270 top

### Tracks (layer width: path | path; a pad name or v marks a point on that pad's centre or on a via)
3.3V  (via drill 0.35, 0.5)
  Top 0.254: R9.2 29.09,9.61 27.18,7.69 26.5,7.69 25.64,6.83 23.34,6.83 22.8,7.38 IC1.7 22.8,9.05 22.25,9.6 IC1.6 IC1.5 21.35,10.1 20.86,9.61 19.76,9.61 18.66,10.71 18.66,12.01 19.06,12.41 19.56,12.41 19.98,12.83 C7.1 | 32.8,31.76 R23.2 | IC2.3 | R16.1 52.8,29.45 Q4.1
  Top 0.406: R3.2 R1.2 | R1.2 28.93,23.69 v28.38,23.14 28.38,21.74 C13.1 | U2.5 22.37,17.93 22.27,18.03 v22.27,18.76 21.47,18.76 20.28,19.95 19.9,19.95 v19.88,19.97 19.88,18.14 C8.1 | C10.2 40.98,44.77 43.12,42.63 45.46,42.63 | 45.46,42.63 50.06,42.63 U4.18 51.03,42.61 C1.2 52.75,41.93 53.26,41.41 v53.26,41.01 | v17.65,15.09 18.89,13.84 C7.1 | R16.1 50.62,29.25 v50.56,29.31 50.56,21.31 49.06,19.81 36.36,19.81 35.01,21.16 IC3.8 35.01,23.83 33.3,25.54 v31.82,25.54 30.82,25.54 30.2,24.91 R1.2 | v34.74,31.72 34.7,31.76 32.8,31.76 | 45.46,42.63 45.4,42.7 IC6.3 | v29.28,39.75 29.22,39.81 IC2.3 | IC2.3 29.22,43.17 30.1,44.05 R20.2
  Bottom 0.254: 29.36,39.06 29.28,39.15 | 30.63,40.74 32.48,40.74
  Bottom 0.406: v17.65,15.09 16.68,16.06 16.68,18.86 17.79,19.97 v19.88,19.97 | v28.38,23.14 28.38,20.8 25.2,17.62 22.85,17.62 22.27,18.2 v22.27,18.76 | v53.26,41.01 53.26,39.31 52.01,38.06 52.01,31.96 50.56,30.51 v50.56,29.31 | v31.82,25.54 33.92,25.54 34.74,26.36 v34.74,31.72 34.74,32.15 32.69,34.2 32.69,36.86 31.31,38.25 30.18,38.25 29.36,39.06 | 29.28,39.15 v29.28,39.75 29.64,39.75 30.63,40.74 DISP1.10 | 32.48,40.74 32.48,41.73 32.88,42.14 DISP1.12
5V_BUCK
  Top 0.254: C12.2 18.42,38.2 R8.2
  Top 0.61: D1.A 20.55,22.97 19.66,23.85 19.66,28.9 21.36,30.6 21.36,33.41
  Top 0.813: R8.2 20.56,38.01 21.46,38.91 24.01,38.91 L1.2
  pour Top (no thermals): 19.86,31.41 19.86,40.91 27.16,40.91 27.16,38.21 22.86,38.21 22.86,31.41
B_PLUS
  Top 0.254: 17.76,45.51 14.06,45.51 12.96,44.41 12.96,41.11 13.86,40.21 15.36,40.21 15.91,39.66 16.49,39.66 16.76,39.93 IC4.EN | IC4.VIN 17.76,45.51 | 17.76,45.51 19.36,45.51 20.46,46.61 C17.2
  Top 0.61: 21.36,49.71 21.36,52.01 20.66,52.71 15.63,52.71 14.37,51.97 11.56,46.91 11.56,30.74 14.46,27.84 D4.1
  pour Top (no thermals): 22.86,51.91 19.76,51.91 19.76,46.11 22.86,46.11
B_PLUS_CON
  Top 0.61: J5.1 29.93,26.3 26.5,26.3 24.96,27.84 D4.2
BACKLIGHT
  Top 0.254: R22.1 31.08,33.46 R23.1
CAN_CS  (via drill 0.35)
  Top 0.254: U4.16 47.26,40.07 v44.2,37.01 | R9.1 32.62,9.61 34.29,11.28 v39.01,11.28 IC3.11
  Bottom 0.254: v44.2,37.01 42.64,35.45 42.64,13.32 40.6,11.28 v39.01,11.28
CAN_INT  (via drill 0.35)
  Top 0.254: U4.12 48.54,34.99 46.86,33.31 46.86,28.84 v48.86,26.84 | v51.49,25.28 51.49,17.46 48.7,14.67 45.16,14.67 43.01,12.52 IC3.13
  Bottom 0.254: v51.49,25.28 50.67,26.1 49.6,26.1 v48.86,26.84
CAN_RXD  (via drill 0.5, 0.51)
  Top 0.254: v43.62,41.34 U4.2 | v46.66,43.41 IC6.4
  Bottom 0.254: v46.66,43.41 46.66,42.31 45.69,41.34 v43.62,41.34 43.62,42.04 45.92,44.34 TP1.P$1
CAN_TXD  (via drill 0.5, 0.51)
  Top 0.254: U4.1 42.02,42.61 v42.3,42.33 | v42.86,44.21 v42.86,44.22 IC6.1
  Bottom 0.254: v42.86,44.21 42.26,43.61 42.26,42.37 v42.3,42.33 46.15,46.18 TP2.P$1
CANH  (via drill 0.35, 0.51)
  Top 0.254: v48.6,51.28 R14.2 47.8,49.78 47.23,49.21 44.47,49.21 44.13,49.56 IC6.7 44.16,50.89 44.16,52.51 43.74,52.92 41.72,52.92 41.3,52.5 D8.1 | R25.2 35.41,49.41 v35.46,49.36 | v42.98,38.77 42.95,38.74 42.95,31.67 37.58,26.3 32.9,26.3 32.26,26.94 J5.3
  Bottom 0.254: v48.6,51.28 48.6,51.77 47.86,52.52 40.32,52.52 37.16,49.36 v35.46,49.36 35.46,48.71 35.96,48.21 40.05,48.21 41.31,46.95 41.31,40.44 v42.98,38.77
CANL  (via drill 0.35)
  Top 0.254: R13.2 50.71,51.04 49.27,52.48 45.46,52.48 45.4,52.54 | D8.2 39.4,52.84 40.29,53.74 | 40.29,53.74 44.2,53.74 45.4,52.54 | 40.29,53.74 38.22,53.74 36.54,52.06 36.54,47.89 v35.74,47.09 33.84,47.09 32.11,48.82 S1.2 | v42.07,38.54 42.07,32.08 39.69,29.69 35.39,29.69 34.7,29 34.7,27.9 34.14,27.34 J5.5 | 45.4,52.54 IC6.6
  Bottom 0.254: v35.74,47.09 39.24,47.09 40.49,45.84 40.49,40.12 v42.07,38.54
CH_PD  (via drill 0.35)
  Top 0.254: IC3.3 v45.01,20.89 | v43.46,18.91 36.09,18.91 33.61,21.39 33.61,22.79 32.71,23.69 R1.1
  Bottom 0.254: v43.46,18.91 44.16,18.91 45.01,19.76 v45.01,20.89
DTR  (via drill 0.5)
  Top 0.254: R4.1 Q2.2 31,18.76 30.59,18.35 v30.59,17.75 | IC1.23 23.28,12.86 23.28,14 v23.26,14.02
  Bottom 0.254: v23.26,14.02 23.26,14.63 24.3,15.67 28.52,15.67 v30.59,17.75
EN
  Top 0.254: R7.1 24.16,19.71 U2.3
GND  (via drill 0.35, 0.5)
  Top 0.254: IC1.2 23.79,11.6 23.79,11.1 IC1.THERM
  Bottom 0.254: v39.26,41.82 36.77,39.34 DISP1.8 32.68,39.34 v32.66,39.31
  other vias: 37.72,15.15 19.84,21.21 29.88,19.78 24.05,10.85 26.21,8.56 34.99,5.54 21.89,8.69 28.89,17.55 23.54,18.71 35.28,10.19 28.72,7.46 58.42,24.26 37.72,31.46 35.12,33.46 44.52,39.26 45.92,40.26 33.42,49.46 33.02,46.26 45.02,27.66 24.86,54.01 21.86,54.01 35.52,12.66 17.32,24.71 43.72,15.15 48.72,16.15 31.42,34.85 38.92,49.66 39.12,45.56 44.12,47.46 42.86,55.01 38.86,55.01 52.62,46.76 37.92,21.01 25.12,25.81
  pour Top (isolate 0.254, rank 2): 24.71,0.06 4.13,35.69 16.01,56.26 48.49,56.26 64.73,28.13 48.53,0.06
  pour Bottom (isolate 0.254, rank 2): 24.74,0 4.13,35.69 16.01,56.26 48.49,56.26 64.73,28.13 48.49,0
GND_BUCK  (via drill 0.35)
  Top 0.254: R2.1 19.16,40.26 v19.16,40.81 | R12.1 v14.86,41.11 | C15.1 v14.86,44.21 | IC4.HYS 17.76,42.31 17.3,42.31 | 17.3,42.31 v17.26,42.31 | R10.1 13.76,41.47 v13.72,41.47 | IC4.GND 18.26,41.31 v18.06,41.51 | IC4.EP1 17.26,42.27 17.3,42.31
  Bottom 0.61: J5.2 31.61,31.49 31.2,31.9 29.2,31.9
  other vias: 27.06,51.11 27.06,50.31 27.06,49.51 27.06,48.71 27.06,47.91 27.06,47.11 26.26,51.11 26.26,50.31 26.26,49.51 26.26,48.71 26.26,47.91 26.26,47.11 27.06,36.21 27.06,35.41 27.06,34.61 27.06,33.81 27.06,33.01 27.06,32.21 26.26,36.21 26.26,35.41 26.26,34.61 26.26,33.81 26.26,33.01 26.26,32.21 16.36,36.21 16.36,35.41 16.36,34.61 16.36,33.81 16.36,33.01 16.36,32.21 15.56,36.21 15.56,35.41 15.56,34.61 15.56,33.81 15.56,33.01 15.56,32.21 16.36,51.11 16.36,50.31 16.36,49.51 16.36,48.71 16.36,47.91 16.36,47.11 15.56,51.11 15.56,50.31 15.56,49.51 15.56,48.71 15.56,47.91 15.56,47.11 16.46,42.31 16.46,41.51 17.26,41.51 18.06,42.31 13.96,39.31 13.96,38.51
  pour Bottom (isolate 0.61, no thermals): 20.78,51.95 30.45,51.95 30.45,34.75 32.15,33.05 32.15,28.4 30.43,28.4 27.38,31.45 20.78,31.45
  pour Bottom (isolate 0.61, no thermals): 28.18,51.93 14.88,51.93 12.88,49.93 12.88,31.43 28.18,31.43
  pour Top (no thermals): 18.1,51.94 18.1,46.14 14.7,46.14 14.7,51.05 15.59,51.94
  pour Top (no thermals): 18.36,37.33 18.36,31.43 14.56,31.43 14.56,37.33
  pour Top (no thermals): 28.16,37.33 28.16,31.43 24.06,31.43 24.06,37.33
  pour Top (no thermals): 28.16,51.93 28.16,46.03 24.56,46.03 24.56,51.93
LED_K  (via drill 0.35)
  Top 0.254: v35.86,43.71 35.36,43.71 34.76,43.11 34.76,37.01 34.17,36.42 R21.2
  Bottom 0.254: 34.3,41.44 36.38,41.44 36.66,41.71 36.66,43.31 36.26,43.71 v35.86,43.71
  Bottom 0.406: DISP1.11 34.3,41.44
MISO  (via drill 0.35)
  Top 0.254: U4.15 47.55,38.8 43.76,35.01 v43.76,33.01 | v43.37,29.38 43.35,29.38 38.99,25.02 38.99,23.06 IC3.6
  Bottom 0.254: v43.76,33.01 43.76,29.77 v43.37,29.38
MOSI  (via drill 0.35)
  Top 0.254: U4.14 47.58,37.53 44.46,34.41 44.46,32.02 37.81,25.37 37.81,24.67 37.01,23.87 IC3.7 37.01,23.75 35.81,24.95 v35.81,25.55
  Bottom 0.254: DISP1.3 35.46,35.84 36.16,35.14 36.16,31.57 38.51,29.21 38.51,27.35 37.71,26.55 36.31,26.55 35.81,26.05 v35.81,25.55
N$1
  Top 0.254: R13.1 C3.2
N$2
  Top 0.254: IC4.SW 18.44,43.31
  Top 0.813: L1.1 19.39,44.26 18.44,43.31
  pour Top (no thermals): 27.16,45.01 27.16,42.31 20.86,42.31 20.86,45.01
N$3
  Top 0.254: R14.1 C4.2
N$4
  Top 0.254: R10.2 13.76,44.33 14.34,44.91 16.93,44.91 17.26,44.57 IC4.ILIM
N$6
  Top 0.254: IC4.FB 17.26,39.71 R2.2 C12.1 R8.1
N$7
  Top 0.254: Q6.1 29.5,36.15 29.5,33.75 R22.2
N$9  (via drill 0.35, 0.5)
  Top 0.254: v19.66,11.11 19.67,11.1 IC1.3 | v31.89,3.71 32.09,3.71 32.3,3.92 J1.D+
  Bottom 0.254: v31.89,3.71 23.86,3.71 18.86,8.71 18.86,10.71 19.26,11.11 v19.66,11.11
N$10  (via drill 0.35, 0.5)
  Top 0.254: IC1.4 22.03,10.61 20.36,10.61 v20.06,10.31 | v26.96,6.41 31.26,6.41 31.65,6.02 J1.D-
  Bottom 0.254: v20.06,10.31 19.55,9.8 19.55,8.81 21.95,6.41 v26.96,6.41
N$11
  Top 0.254: R21.1 32.94,38.32 30.52,38.32 Q6.3
N$12
  Top 0.254: R4.2 30,16.51 30.79,15.72 30.79,13.87 31.17,13.49 31.43,13.49 Q1.1
N$13
  Top 0.254: R5.2 32.64,14.71 33.1,15.17 33.1,18.72 32.19,19.63 30.92,19.63 30.04,18.76 Q2.1
N$14
  Top 0.254: C15.2 16.76,44.21 IC4.SS
N$15
  Top 0.254: R12.2 16.26,43.26 IC4.RT
N$17
  Top 0.254: S1.1 R25.1
N$19
  Top 0.254: R15.2 37.64,48.85 38.11,48.38 42.37,48.38 42.89,48.9 42.89,50.83 IC6.8
N$22
  Top 0.254: C20.2 38.25,34.8 38.25,36.64 Q3.3 38.35,36.22 39.35,35.22 39.35,34.6 40.23,33.72 U4.8
N$23
  Top 0.254: C19.2 36.05,42.05 Q3.1 36.05,40.49 36.06,40.5 36.06,39.1 36.57,38.59 38.58,38.59 39.36,37.81 39.36,35.91 40.28,34.99 U4.7
N$26  (via drill 0.5)
  Top 0.254: R26.2 v56.66,32.31
  Bottom 0.254: LED4.4-DIN 59.91,31.86 59.46,32.31 v56.66,32.31
PORTAL_PIN  (via drill 0.5)
  Top 0.254: IC3.14 45.01,12.06 v44.96,12.11 | v47.96,29.91 49.56,29.91 51.66,32.01 51.66,34.71 52.86,35.91 57.08,35.91 S2.1
  Bottom 0.254: v44.96,12.11 44.96,18.34 46.09,19.47 46.09,28.09 47.91,29.91 v47.96,29.91
RESET  (via drill 0.35, 0.5)
  Top 0.254: R3.1 34.34,19.56 v34.34,16.25 34.34,13.14 33.42,12.22 31.94,12.22 Q1.3 30.79,11.33 30.08,12.05 v29.9,12.05 | v31.05,39.48 30.82,39.48 30.32,39.98 30.32,41.81 31.14,42.63 IC2.2 32.84,42.63 R20.1 33.7,42.35 34.16,42.81 34.16,45.41 34.66,45.91 37.38,45.91 39.24,47.77 42.82,47.77 v43.46,48.41 | v46.91,16.29 v40.21,16.29 | v48.96,21.01 49.01,21.06 IC3.1 49.01,25.09 48.2,25.9 43.9,25.9 43.01,25.01 IC3.4 | U4.17 49.95,41.21 v47.86,41.21 | v48.26,12.81 v51.56,12.81 53.56,12.81 55.26,14.51 55.26,16.36 | v57.31,18.86 56.26,18.86 55.26,17.86 55.26,16.36 | S5.1 55.26,16.36
  Bottom 0.254: v29.9,12.05 29.07,12.05 26.58,14.54 25.21,14.54 24.65,13.98 24.65,11.77 27.81,8.61 33.46,8.61 35.06,7.01 47.46,7.01 51.56,11.11 v51.56,12.81 | DISP1.6 33.04,37.94 31.49,39.48 v31.05,39.48 | v40.21,16.29 40.17,16.25 v34.34,16.25 | v48.96,21.01 48.16,20.21 48.16,17.54 v46.91,16.29 | v43.46,48.41 49.2,48.41 54.5,43.11 54.5,35.2 56.39,33.31 59.69,33.31 61.1,31.9 61.1,25 58.11,22.01 58.11,19.66 v57.31,18.86 | v47.86,41.21 47.86,33.13 49.31,31.68 49.31,29.29 47.31,27.28 47.31,19.06 45.96,17.71 45.96,13.51 46.66,12.81 v48.26,12.81
RTS
  Top 0.254: IC1.19 25.39,12.75 28.44,12.75 28.72,13.03 28.72,14.23 29.27,14.79 29.78,14.79 R5.1 29.94,13.27 Q1.2
RXD  (via drill 0.5)
  Top 0.254: R11.2 27.7,10.14 v27.58,10.14 | IC3.15 47.01,9.53 v46.48,10.06
  Bottom 0.254: v27.58,10.14 28.26,9.45 33.77,9.45 35.61,7.61 43.43,7.61 45.88,10.06 v46.48,10.06
SCK  (via drill 0.35)
  Top 0.254: U4.13 47.67,36.26 45.26,33.85 45.26,29.69 41.01,25.44 IC3.5 41.01,21.55 40.74,21.28 40.01,21.28 v40,21.29
  Bottom 0.254: DISP1.4 38.16,36.54 39.14,35.55 39.14,21.51 39.36,21.29 v40,21.29
TFT_CS  (via drill 0.35, 0.5)
  Top 0.254: v41.91,14.19 41.91,9.34 41.01,8.44 | 41.01,8.44 IC3.12 | v31.95,20.43 31.52,20.86 Q2.3 | v38.81,13.99 40.11,12.69 40.11,9.34 41.01,8.44
  Bottom 0.254: DISP1.7 39.71,38.64 40.83,37.51 40.83,24.28 41.91,23.2 v41.91,14.19 | v31.95,20.43 31.95,19.06 32.91,18.1 32.91,14.69 33.61,13.99 v38.81,13.99
TFT_DC  (via drill 0.35)
  Top 0.254: v37.91,10.19 37.91,9.24 37.01,8.34 IC3.10 37.01,8.38 35.98,9.42 33.92,9.42 33.5,9 33.5,8.2 33.11,7.81 R6.2
  Bottom 0.254: DISP1.5 39.16,37.24 39.99,36.4 39.99,23.77 41.11,22.65 41.11,13.31 40.4,12.6 38.66,12.6 37.85,11.79 37.85,10.25 v37.91,10.19
TXD  (via drill 0.5)
  Top 0.254: IC1.20 24.8,13.5 24.94,13.64 26.08,13.64 v26.27,13.45 | R16.2 Q4.2 | IC3.16 49.04,7.67
  Top 0.406: R16.2 52.66,27.49 v52.66,19.31 | 49.04,7.67 v49.04,11.58
  Bottom 0.254: v49.04,11.58 46.3,11.58 42.94,8.22 35.97,8.22 33.84,10.34 28.6,10.34 26.27,12.67 v26.27,13.45
  Bottom 0.406: v52.66,19.31 52.66,18.19 49.74,15.28 49.74,12.28 v49.04,11.58
TXD_5V
  Top 0.254: Q4.3 56.7,28.5 57.55,29.35 R17.2 58.4,30.5 58.1,30.8 53.4,30.8 53.04,31.16 R26.1
USB_RX
  Top 0.254: IC1.21 24.3,13.77 24.81,14.28 26.94,14.28 R11.1
VCC  (via drill 0.5)
  Top 0.254: IC1.8 23.3,8.36 23.68,7.97 v23.68,7.67
  Top 0.406: R7.2 25.69,21.04 26.28,20.45 26.28,18.28 25.81,17.81 U2.1 24.97,16.9 24.27,16.2 v23.27,16.2 | v18.5,16.24 17.68,17.06 C6.1 16.68,18.78 15.9,18 15.9,15.58 18.06,13.41 18.06,10.43 24.67,3.82 30.69,3.82 31,4.13 J1.VBUS | R17.1 59.6,27.65 59.96,28.01 v59.96,28.51 59.96,28.81 60.36,29.21 C9.1 | v50.16,18.26 49.36,17.46 v39.56,17.46 | v27.55,24.2 27.55,23.67 26.85,22.97 D1.C
  Top 0.61: R7.2 25.55,22.07 D1.C
  Bottom 0.254: 23.27,16.24 v23.27,16.2 | 59.96,25.71 LED4.1-VDD
  Bottom 0.406: 23.27,16.24 22.06,16.24 v18.5,16.24 | v23.68,7.67 23.68,7.64 23.52,7.47 21.8,7.47 20.96,8.31 20.96,13.89 v23.27,16.2 | 59.96,25.71 v59.96,28.51 56.46,28.51 55.16,27.21 55.16,25.06 53.83,23.73 52.03,23.73 50.16,21.86 v50.16,18.26 | v39.56,17.46 35.41,17.46 33.26,19.61 33.26,23.56 32.22,24.6 27.95,24.6 v27.55,24.2

### Text on the board
tPlace: 4MB Flash / 80MHz & 3.3V